# Altium schematic sheet RFAutoMaTE.SchDoc
size A4; SheetNumber: 4; SheetTotal: 4
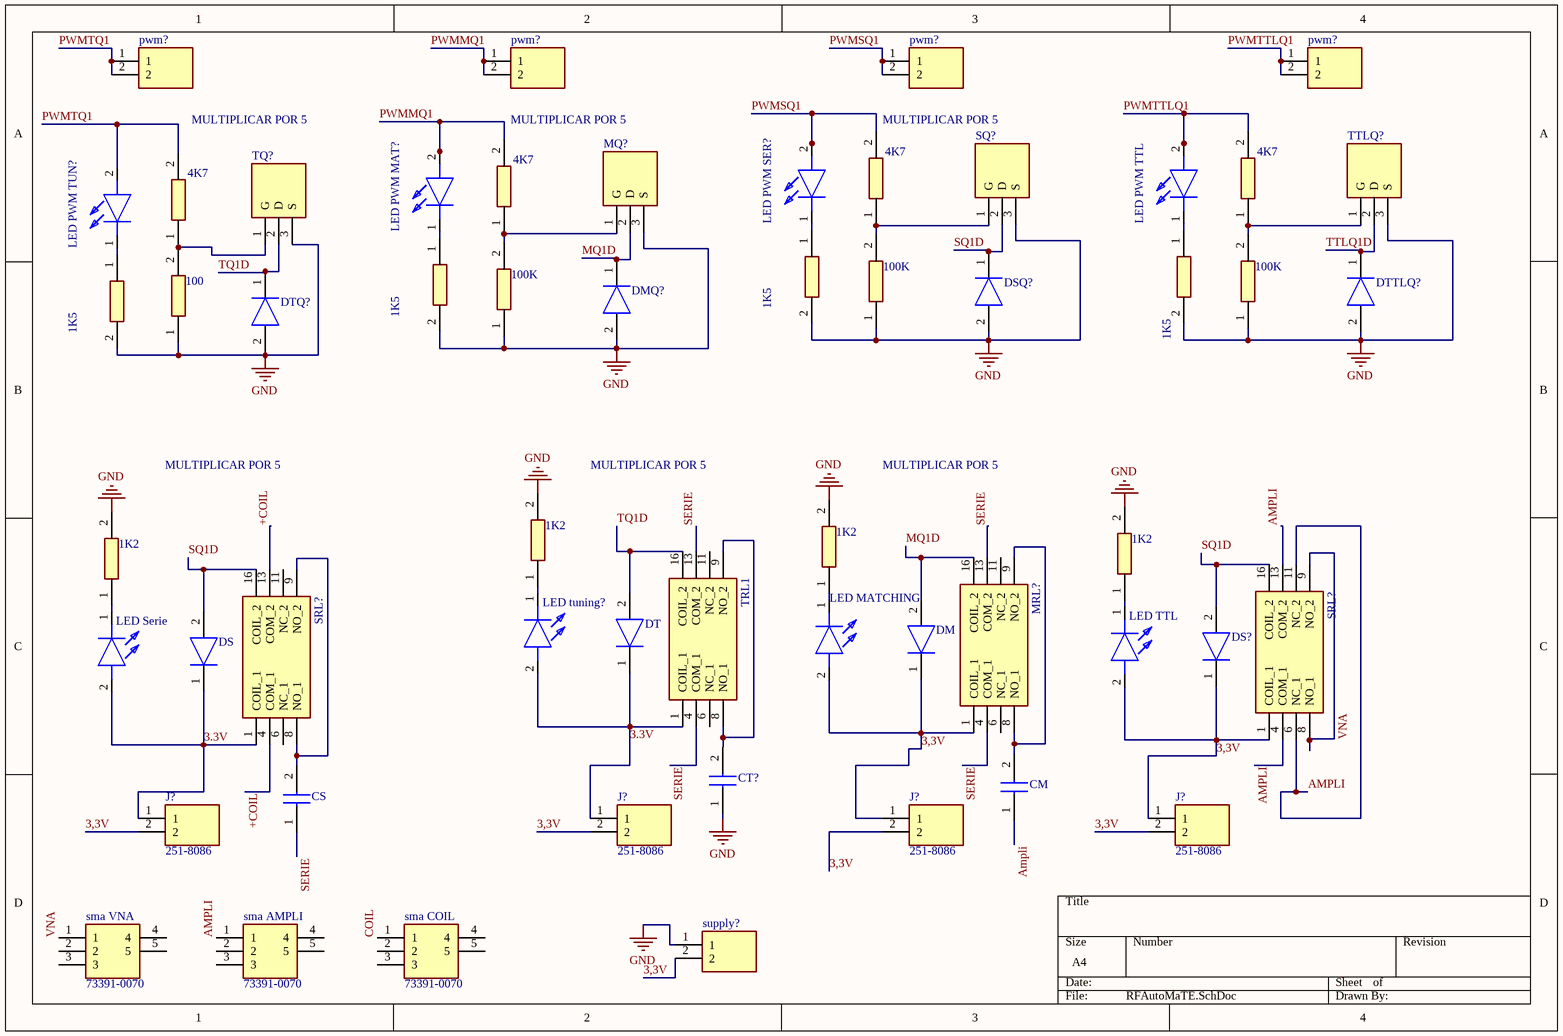
[diagram p0: RFAutoMaTE.SchDoc]

## Parts
(Parts that share a designator on the sheet are numbered #1, #2 ... from top to bottom, then left to right.)
1K2#1  (no value)  [RESAD1650W60L650D250]
1K2#2  (no value)  [RESAD1650W60L650D250]
1K2#3  (no value)  [RESAD1650W60L650D250]
1K2#4  (no value)  [RESAD1650W60L650D250]
1K5#1  (no value)  [RESAD1650W60L650D250]
1K5#2  (no value)  [RESAD1650W60L650D250]
1K5#3  (no value)  [RESAD1650W60L650D250]
1K5#4  (no value)  [RESAD1650W60L650D250]
4K7#1  (no value)  [RESAD1650W60L650D250]
4K7#2  (no value)  [RESAD1650W60L650D250]
4K7#3  (no value)  [RESAD1650W60L650D250]
4K7#4  (no value)  [RESAD1650W60L650D250]
100  (no value)  [RESAD1650W60L650D250]
100K#1  (no value)  [RESAD1650W60L650D250]
100K#2  (no value)  [RESAD1650W60L650D250]
100K#3  (no value)  [RESAD1650W60L650D250]
CM  (no value)  [009296001202806]
CS  (no value)  [009296001202806]
CT?  (no value)  [009296001202806]
DM  (no value)  [DIOAD1068W53L380D172]
DMQ?  (no value)  [DIOAD1068W53L380D172]
DS  (no value)  [DIOAD1068W53L380D172]
DS?  (no value)  [DIOAD1068W53L380D172]
DSQ?  (no value)  [DIOAD1068W53L380D172]
DT  (no value)  [DIOAD1068W53L380D172]
DTQ?  (no value)  [DIOAD1068W53L380D172]
DTTLQ?  (no value)  [DIOAD1068W53L380D172]
J?#1  251-8086  [HDRV2W66P0X254_1X2_508X254X874P]
J?#2  251-8086  [HDRV2W66P0X254_1X2_508X254X874P]
J?#3  251-8086  [HDRV2W66P0X254_1X2_508X254X874P]
J?#4  251-8086  [HDRV2W66P0X254_1X2_508X254X874P]
LED_MATCHING  L53GD  [L53GD]  (value not drawn)
LED_PWM_MAT?  L53GD  [L53GD]  (value not drawn)
LED_PWM_SER?  L53GD  [L53GD]  (value not drawn)
LED_PWM_TTL  L53GD  [L53GD]  (value not drawn)
LED_PWM_TUN?  L53GD  [L53GD]  (value not drawn)
LED_Serie  L53GD  [L53GD]  (value not drawn)
LED_TTL  L53GD  [L53GD]  (value not drawn)
LED_tuning?  L53GD  [L53GD]  (value not drawn)
MQ?  (no value)  [TO254P483X1016X2223-3P]
MRL?  (no value)  [G5V2DC3]
pwm?#1  691213710002  [691213710002]  (value not drawn)
pwm?#2  691213710002  [691213710002]  (value not drawn)
pwm?#3  691213710002  [691213710002]  (value not drawn)
pwm?#4  691213710002  [691213710002]  (value not drawn)
sma_AMPLI  73391-0070  [733910070]
sma_COIL  73391-0070  [733910070]
sma_VNA  73391-0070  [733910070]
SQ?  (no value)  [TO254P483X1016X2223-3P]
SRL?#1  (no value)  [G5V2DC3]
SRL?#2  (no value)  [G5V2DC3]
supply?  691213710002  [691213710002]  (value not drawn)
TQ?  (no value)  [TO254P483X1016X2223-3P]
TRL1  (no value)  [G5V2DC3]
TTLQ?  (no value)  [TO254P483X1016X2223-3P]

## Nets
GND: 1K2#1.2 1K2#2.2 1K2#3.2 1K2#4.2 1K5#1.2 1K5#2.2 1K5#3.2 1K5#4.2 100.1 100K#1.1 100K#2.1 100K#3.1 CT?.1 DMQ?.2(A) DSQ?.2(A) DTQ?.2(A) DTTLQ?.2(A) MQ?.3(S) SQ?.3(S) supply?.1 TQ?.3(S) TTLQ?.3(S)
3,3V: DM.1(K) DS?.1(K) J?#1.2 J?#2.2 J?#3.1 J?#3.2 J?#4.1 J?#4.2 LED_MATCHING.2(A) LED_TTL.2(A) MRL?.1(COIL_1) SRL?#1.1(COIL_1) supply?.2
3.3V: DS.1(K) DT.1(K) J?#1.1 J?#2.1 LED_Serie.2(A) LED_tuning?.2(A) SRL?#2.1(COIL_1) TRL1.1(COIL_1)
+COIL: SRL?#2.4(COM_1) SRL?#2.13(COM_2)
Ampli: CM.1 sma_AMPLI.1 SRL?#1.4(COM_1) SRL?#1.6(NC_1) SRL?#1.11(NC_2) SRL?#1.13(COM_2)
COIL: sma_COIL.1
MQ1D: DM.2(A) DMQ?.1(K) MQ?.2(D) MRL?.16(COIL_2)
PWMMQ1: 4K7#3.2 LED_PWM_MAT?.2(A) pwm?#2.1 pwm?#2.2
PWMSQ1: 4K7#1.2 LED_PWM_SER?.2(A) pwm?#3.1 pwm?#3.2
PWMTQ1: 4K7#4.2 LED_PWM_TUN?.2(A) pwm?#1.1 pwm?#1.2
PWMTTLQ1: 4K7#2.2 LED_PWM_TTL.2(A) pwm?#4.1 pwm?#4.2
SERIE: CS.1 MRL?.4(COM_1) MRL?.13(COM_2) TRL1.4(COM_1) TRL1.13(COM_2)
SQ1D: DS.2(A) DS?.2(A) DSQ?.1(K) SQ?.2(D) SRL?#1.16(COIL_2) SRL?#2.16(COIL_2)
TQ1D: DT.2(A) DTQ?.1(K) TQ?.2(D) TRL1.16(COIL_2)
TTLQ1D: DTTLQ?.1(K) TTLQ?.2(D)
VNA: sma_VNA.1 SRL?#1.8(NO_1) SRL?#1.9(NO_2)
Net1K2#1_1: 1K2#1.1 LED_tuning?.1(K)
Net1K2#2_1: 1K2#2.1 LED_MATCHING.1(K)
Net1K2#3_1: 1K2#3.1 LED_TTL.1(K)
Net1K2#4_1: 1K2#4.1 LED_Serie.1(K)
Net1K5#1_1: 1K5#1.1 LED_PWM_SER?.1(K)
Net1K5#2_1: 1K5#2.1 LED_PWM_TTL.1(K)
Net1K5#3_1: 1K5#3.1 LED_PWM_MAT?.1(K)
Net1K5#4_1: 1K5#4.1 LED_PWM_TUN?.1(K)
Net4K7#1_1: 4K7#1.1 100K#1.2 SQ?.1(G)
Net4K7#2_1: 4K7#2.1 100K#2.2 TTLQ?.1(G)
Net4K7#3_1: 4K7#3.1 100K#3.2 MQ?.1(G)
Net4K7#4_1: 4K7#4.1 100.2 TQ?.1(G)
NetCM_2: CM.2 MRL?.8(NO_1) MRL?.9(NO_2)
NetCS_2: CS.2 SRL?#2.8(NO_1) SRL?#2.9(NO_2)
NetCT?_2: CT?.2 TRL1.8(NO_1) TRL1.9(NO_2)

Not connected (* = marked no-connect by the designer): MRL? 6(NC_1) 11(NC_2); sma_AMPLI 2 3 4 5; sma_COIL 2 3 4 5; sma_VNA 2 3 4 5; SRL?#2 6(NC_1) 11(NC_2); TRL1 6(NC_1) 11(NC_2)

## Notes on the sheet
- MULTIPLICAR POR 5

## Library data of the parts
1K2#1-1K2#4 1K5#1-1K5#4 4K7#1-4K7#4 100 100K#1-100K#3 = MRS25000C1000FC100: Resistor; Manufacturer_Name: Vishay; Datasheet Link: http://www.vishay.com/docs/28724/mrs16m25.pdf; Manufacturer_Part_Number: MRS25000C1000FC100; Mouser Part Number: 594-2322-156-11001; Mouser Price/Stock: https://www.mouser.co.uk/ProductDetail/Vishay-BC-Components/MRS25000C1000FC100?qs=H30XFsNYD%2FEegjN4bN4g8Q%3D%3D; Arrow Part Number: MRS25000C1000FC100; Arrow Price/Stock: https://www.arrow.com/en/products/mrs25000c1000fc100/vishay?region=europe
CM CS CT? = 0505C470FP151X: Capacitor; Manufacturer_Name: Passive Plus Inc.; Datasheet Link: https://www.passiveplus.com/pdf/PPI-0505CP.DATASHEET.pdf; Height: 1.45mm; Manufacturer_Part_Number: 0505C470FP151X
DM DMQ? DS DS? DSQ? DT DTQ? DTTLQ? = 1N4148TA: Diode; Manufacturer_Name: ON Semiconductor; Manufacturer_Part_Number: 1N4148TA; Mouser Part Number: 512-1N4148TA; Mouser Price/Stock: https://www.mouser.co.uk/ProductDetail/ON-Semiconductor-Fairchild/1N4148TA?qs=yitr4%2FftwBD5qsyZHK1L7g%3D%3D; Arrow Part Number: 1N4148TA; Arrow Price/Stock: https://www.arrow.com/en/products/1n4148ta/on-semiconductor?region=nac
J?#1-J?#4 = 251-8086: Connector; Manufacturer_Name: RS Components; Height: 9.4mm; Manufacturer_Part_Number: 251-8086
LED_MATCHING LED_PWM_MAT? LED_PWM_SER? LED_PWM_TTL LED_PWM_TUN? LED_Serie LED_TTL LED_tuning? = L53GD: LED; Manufacturer_Name: Kingbright; Datasheet Link: https://www.mouser.com/datasheet/2/216/kingbright_kngbd00006_61-2493164.pdf; Height: 9.6mm; Manufacturer_Part_Number: L53GD; Mouser Part Number: 604-L53GD; Mouser Price/Stock: https://www.mouser.co.uk/ProductDetail/Kingbright/L53GD?qs=85uWm5%252BqJhX4nPtCjTqKbQ%3D%3D
MQ? SQ? TQ? TTLQ? = IRFZ44n: Transistor; Manufacturer_Name: Infineon; Datasheet Link: http://www.irf.com/product-info/datasheets/data/irfz44n.pdf; Height: 4.83mm; Manufacturer_Part_Number: IRFZ44n
MRL? SRL?#1 SRL?#2 TRL1 = G5V-2-DC3: Relay or Contactor; Manufacturer_Name: Omron Electronics; Datasheet Link: https://omronfs.omron.com/en_US/ecb/products/pdf/en-g5v_2.pdf; Height: 11.5mm; Manufacturer_Part_Number: G5V-2-DC3; Mouser Part Number: 653-G5V-2-DC3; Mouser Price/Stock: https://www.mouser.co.uk/ProductDetail/Omron-Electronics/G5V-2-DC3?qs=wg6chLqwgwqby6W2klCjkg%3D%3D; Arrow Part Number: G5V-2-DC3; Arrow Price/Stock: https://www.arrow.com/en/products/g5v-2-dc3/omron?region=nac
pwm?#1-pwm?#4 supply? = 691213710002: Connector; Manufacturer_Name: Wurth Elektronik; Datasheet Link: https://docs.rs-online.com/5993/0900766b8133a1df.pdf; Height: 10.2mm; Manufacturer_Part_Number: 691213710002; Mouser Part Number: 710-691213710002; Mouser Price/Stock: https://www.mouser.co.uk/ProductDetail/Wurth-Elektronik/691213710002?qs=7gQLVZk5cPkuKXksY6RqhA%3D%3D
sma_AMPLI sma_COIL sma_VNA = 73391-0070: Connector; Manufacturer_Name: Molex; Datasheet Link: https://datasheet.datasheetarchive.com/originals/distributors/Datasheets_SAMA/cd6bf19b0e4973497e5cb3fc39017d1b.pdf; Height: 10mm; Manufacturer_Part_Number: 73391-0070; Mouser Part Number: 538-73391-0070; Mouser Price/Stock: https://www.mouser.co.uk/ProductDetail/Molex/73391-0070?qs=Vtbn2VVmZzEJo591qvlOmw%3D%3D